# Altium project AirPi_Sensor.PrjPcb
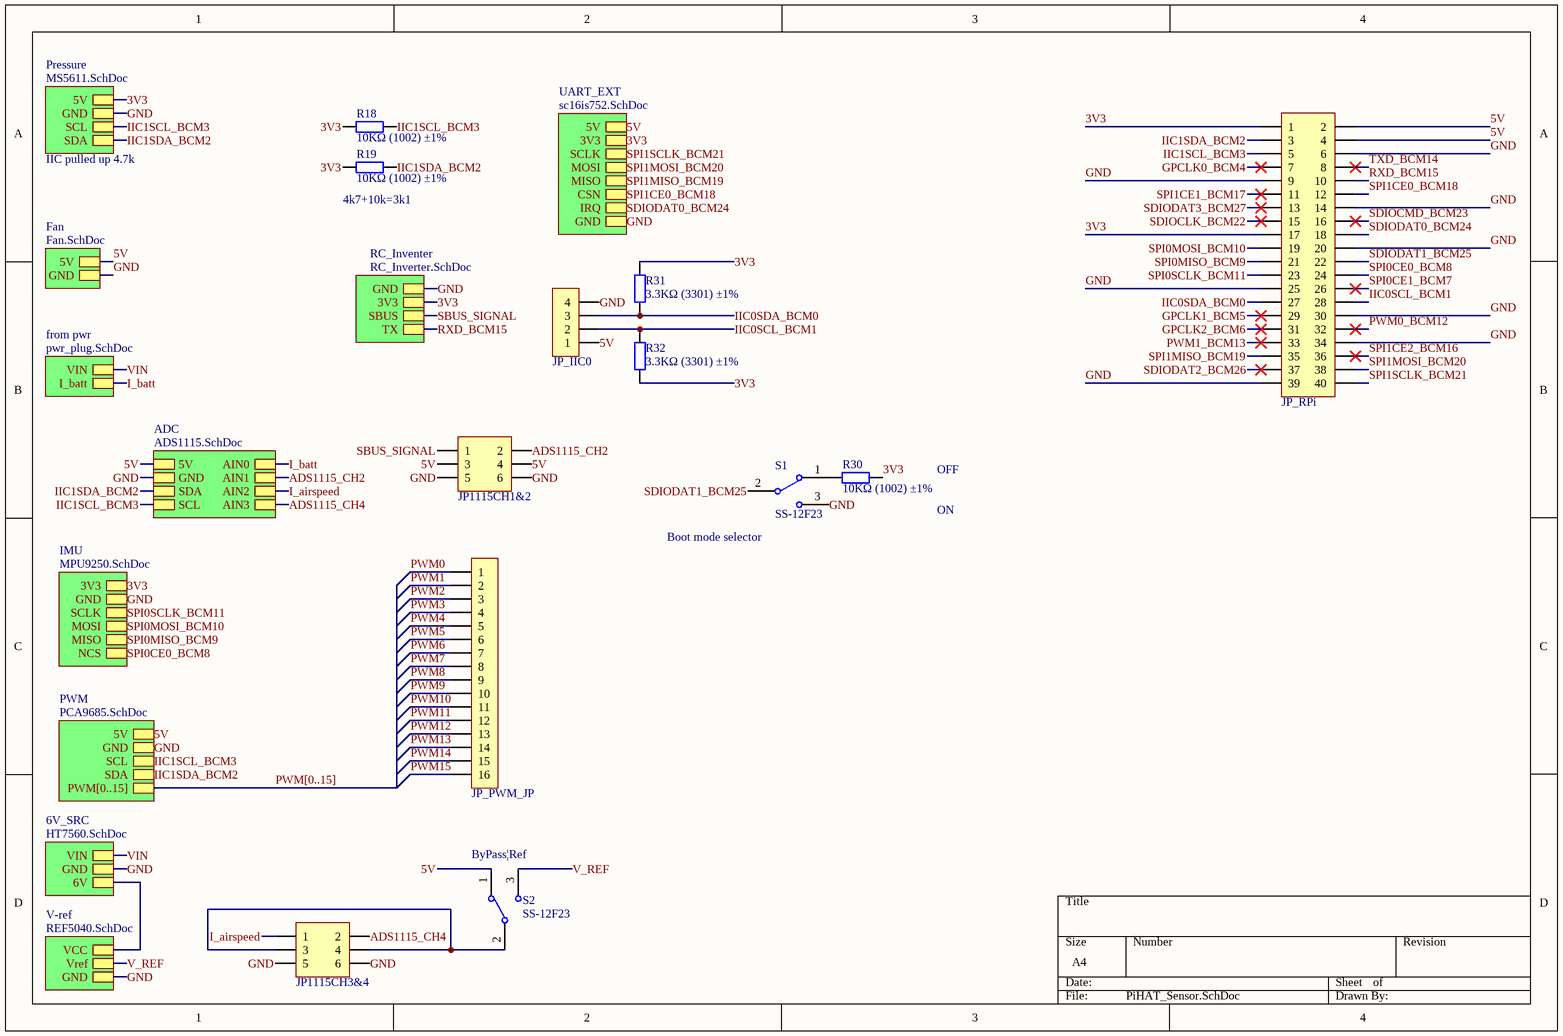
[diagram p0: PiHAT_Sensor.SchDoc]
11 sheets, 65 parts. Net scope: hierarchical (ports join the sheet entries above them; power ports are global).
Board file: AirPi_Sensor.PcbDoc
Sheets:
  PiHAT_Sensor.SchDoc
    Fan = Fan.SchDoc
    V-ref = REF5040.SchDoc
    from pwr = pwr_plug.SchDoc
    Pressure = MS5611.SchDoc
    ADC = ADS1115.SchDoc
    IMU = MPU9250.SchDoc
    PWM = PCA9685.SchDoc
    RC_Inventer = RC_Inverter.SchDoc
    UART_EXT = sc16is752.SchDoc
    6V_SRC = HT7560.SchDoc

## Sheet PiHAT_Sensor.SchDoc
size A4

### Parts
JP1115CH1&2  Header3X2  [HDR2.54-WI-2x3P]  (value not drawn)
JP1115CH3&4  Header3X2  [HDR2.54-WI-2x3P]  (value not drawn)
JP_IIC0  HDR-1X4  [MX 1.25-WS-4P]  (value not drawn)
JP_PWM_JP  HDR-1X16  [HDR2.54-LI-16P]  (value not drawn)
JP_RPi  Header 2X11  [HDR2.54-LI-2x20P]  (value not drawn)
R18  10KΩ (1002) ±1%  [0402_R]
R19  10KΩ (1002) ±1%  [0402_R]
R30  10KΩ (1002) ±1%  [0402_R]
R31  3.3KΩ (3301) ±1%  [0402_R]
R32  3.3KΩ (3301) ±1%  [0402_R]
S1  SS-12F23  [MSK-12C01-07]
S2  SS-12F23  [MSK-12C01-07]

### Sub-sheets
6V_SRC = HT7560.SchDoc: 6V, GND, VIN
ADC = ADS1115.SchDoc: SDA, AIN0, AIN3, AIN1, AIN2, 5V, GND, SCL
Fan = Fan.SchDoc: 5V, GND
from pwr = pwr_plug.SchDoc: I_batt, VIN
IMU = MPU9250.SchDoc: NCS, 3V3, GND, SCLK, MOSI, MISO
Pressure = MS5611.SchDoc: 5V, SCL, GND, SDA
PWM = PCA9685.SchDoc: PWM[0..15], SDA, SCL, GND, 5V
RC_Inventer = RC_Inverter.SchDoc: GND, TX, 3V3, SBUS
UART_EXT = sc16is752.SchDoc: CSN, 5V, SCLK, 3V3, GND, IRQ, MOSI, MISO
V-ref = REF5040.SchDoc: VCC, Vref, GND

### Nets
3V3: JP_RPi.1 JP_RPi.17 R18.1 R19.1 R30.2 R31.2 R32.1 ; sheet Pressure/5V, sheet IMU/3V3, sheet RC_Inventer/3V3, sheet UART_EXT/3V3
5V: JP1115CH1&2.3 JP1115CH1&2.4 JP_IIC0.1 JP_RPi.2 JP_RPi.4 S2.1 ; sheet Fan/5V, sheet ADC/5V, sheet PWM/5V, sheet UART_EXT/5V
ADS1115_CH2: JP1115CH1&2.2 ; sheet ADC/AIN1
ADS1115_CH4: JP1115CH3&4.2 ; sheet ADC/AIN3
GND: JP1115CH1&2.5 JP1115CH1&2.6 JP1115CH3&4.5 JP1115CH3&4.6 JP_IIC0.4 JP_RPi.6 JP_RPi.9 JP_RPi.14 JP_RPi.20 JP_RPi.25 JP_RPi.30 JP_RPi.34 JP_RPi.39 S1.3 ; sheet Fan/GND, sheet V-ref/GND, sheet Pressure/GND, sheet ADC/GND, sheet IMU/GND, sheet PWM/GND, sheet RC_Inventer/GND, sheet UART_EXT/GND, sheet 6V_SRC/GND
GPCLK0_BCM4: JP_RPi.7
GPCLK1_BCM5: JP_RPi.29
GPCLK2_BCM6: JP_RPi.31
I_airspeed: JP1115CH3&4.1 ; sheet ADC/AIN2
I_batt: sheet from pwr/I_batt, sheet ADC/AIN0
IIC0SCL_BCM1: JP_IIC0.2 JP_RPi.28 R32.2
IIC0SDA_BCM0: JP_IIC0.3 JP_RPi.27 R31.1
IIC1SCL_BCM3: JP_RPi.5 R18.2 ; sheet Pressure/SCL, sheet ADC/SCL, sheet PWM/SCL
IIC1SDA_BCM2: JP_RPi.3 R19.2 ; sheet Pressure/SDA, sheet ADC/SDA, sheet PWM/SDA
PWM0: JP_PWM_JP.1
PWM0_BCM12: JP_RPi.32
PWM1: JP_PWM_JP.2
PWM1_BCM13: JP_RPi.33
PWM2: JP_PWM_JP.3
PWM3: JP_PWM_JP.4
PWM4: JP_PWM_JP.5
PWM5: JP_PWM_JP.6
PWM6: JP_PWM_JP.7
PWM7: JP_PWM_JP.8
PWM8: JP_PWM_JP.9
PWM9: JP_PWM_JP.10
PWM10: JP_PWM_JP.11
PWM11: JP_PWM_JP.12
PWM12: JP_PWM_JP.13
PWM13: JP_PWM_JP.14
PWM14: JP_PWM_JP.15
PWM15: JP_PWM_JP.16
RXD_BCM15: JP_RPi.10 ; sheet RC_Inventer/TX
SBUS_SIGNAL: JP1115CH1&2.1 ; sheet RC_Inventer/SBUS
SDIOCLK_BCM22: JP_RPi.15
SDIOCMD_BCM23: JP_RPi.16
SDIODAT0_BCM24: JP_RPi.18 ; sheet UART_EXT/IRQ  [project net IRQ]
SDIODAT1_BCM25: JP_RPi.22 S1.2
SDIODAT2_BCM26: JP_RPi.37
SDIODAT3_BCM27: JP_RPi.13
SPI0CE0_BCM8: JP_RPi.24 ; sheet IMU/NCS
SPI0CE1_BCM7: JP_RPi.26
SPI0MISO_BCM9: JP_RPi.21 ; sheet IMU/MISO
SPI0MOSI_BCM10: JP_RPi.19 ; sheet IMU/MOSI
SPI0SCLK_BCM11: JP_RPi.23 ; sheet IMU/SCLK
SPI1CE0_BCM18: JP_RPi.12 ; sheet UART_EXT/CSN  [project net CSN]
SPI1CE1_BCM17: JP_RPi.11
SPI1CE2_BCM16: JP_RPi.36
SPI1MISO_BCM19: JP_RPi.35 ; sheet UART_EXT/MISO  [project net MISO]
SPI1MOSI_BCM20: JP_RPi.38 ; sheet UART_EXT/MOSI  [project net MOSI]
SPI1SCLK_BCM21: JP_RPi.40 ; sheet UART_EXT/SCLK  [project net SCLK]
TXD_BCM14: JP_RPi.8
V_REF: S2.3 ; sheet V-ref/Vref
VIN: sheet from pwr/VIN, sheet 6V_SRC/VIN
NetC3_2: sheet V-ref/VCC, sheet 6V_SRC/6V
NetJP1115CH3&4_3: JP1115CH3&4.3 JP1115CH3&4.4 S2.2
NetR30_1: R30.1 S1.1

### Buses and harness runs
bus PWM[0..15] = sheet PWM/PWM[0..15]

### Notes on the sheet
- IIC pulled up 4.7k
- (near R19) 4k7+10k=3k1
- OFF
- ON
- (near S1) Boot mode selector
- (near S2) ByPass|Ref

### Library data of the parts
JP1115CH1&2 JP1115CH3&4 = Header 3X2: 3*2P接插件; 版权归属: 源创客; BOM名称: 3*2P接插件; 学习资源: www.ooocke.com
JP_IIC0 = Header 4: 4P接插件; 版权归属: 源创客; BOM名称: 4P接插件; 学习资源: www.ooocke.com
JP_PWM_JP = Header 16: 16P接插件; 版权归属: 源创客; BOM名称: 16P接插件; 学习资源: www.ooocke.com
JP_RPi = Header 20X2: 20*2P接插件; 版权归属: 源创客; BOM名称: 20*2P接插件; 学习资源: www.ooocke.com
R18 R19 R30 = 0402 10KΩ (1002) 1%: 贴片电阻; ComponentLink1Description: 供应商链接; ComponentLink1URL: http://www.szlcsc.com/product/details_26487.html; Package: 0402; Supplier: LC; SuppliersPartNumber: C25744
R31 R32 = 0402 3.3KΩ (3301) 1%: 贴片电阻; ComponentLink1Description: 供应商链接; ComponentLink1URL: http://www.szlcsc.com/product/details_26633.html; Package: 0402; Supplier: LC; SuppliersPartNumber: C25890
S1 S2 = SSW-1P: 1路波动开关; BOM名称: 波动开关; 版权归属: 源创客; 学习资源: www.ooocke.com

## Sheet Fan.SchDoc
size A4
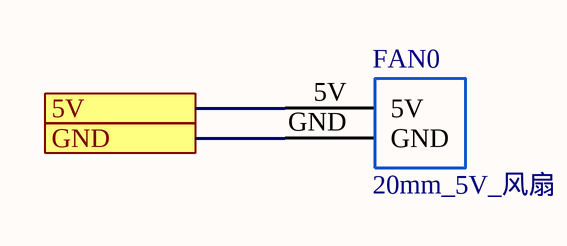
[diagram p1: Fan.SchDoc]

### Parts
FAN0  20mm_5V_风扇  [20mmFAN]

### Ports
5V, GND

### Nets
5V: FAN0.5V ; port 5V
GND: FAN0.GND ; port GND

### Library data of the parts
FAN0 = 20mmFAN: pin to pad: 5V>7 GND>6

## Sheet REF5040.SchDoc
size A4
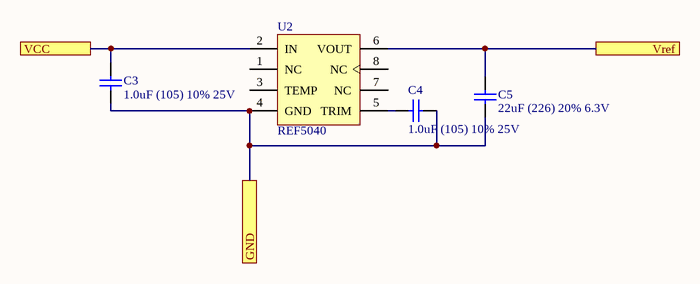
[diagram p2: REF5040.SchDoc]

### Parts
C3  1.0uF (105) 10% 25V  [0402_C]
C4  1.0uF (105) 10% 25V  [0402_C]
C5  22uF (226) 20% 6.3V  [0603_C]
U2  REF5040  [SOP8_N]

### Ports
GND, VCC, Vref

### Nets
GND: C3.1 C4.2 C5.1 U2.4(GND) ; port GND
V_REF: C5.2 U2.6(VOUT) ; port Vref
NetC3_2: C3.2 U2.2(IN) ; port VCC
NetC4_1: C4.1 U2.5(TRIM)

Not connected (* = marked no-connect by the designer): U2 1(NC) 3(TEMP) 7(NC) 8(NC)

### Library data of the parts
C3 C4 = 0402 1.0uF (105) 10% 25V: 贴片电容; ComponentLink1Description: 供应商链接; ComponentLink1URL: http://www.szlcsc.com/product/details_53938.html; Package: 0402; Supplier: LC; SuppliersPartNumber: C52923
C5 = 0603 22uF (226) 20% 6.3V: 贴片电容; ComponentLink1Description: 供应商链接; ComponentLink1URL: http://www.szlcsc.com/product/details_60514.html; Package: 0603; Supplier: LC; SuppliersPartNumber: C59461
U2 = REF5040: 高精度电压基准; 版权归属: 源创客; BOM名称: 高精度电压基准; 学习资源: www.ooocke.com

## Sheet pwr_plug.SchDoc
size A4
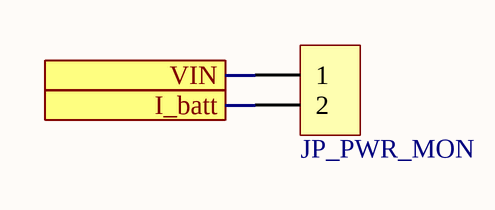
[diagram p3: pwr_plug.SchDoc]

### Parts
JP_PWR_MON  HDR-1X2  [HDR2.54-LI-2P]  (value not drawn)

### Ports
I_batt, VIN

### Nets
I_batt: JP_PWR_MON.2 ; port I_batt
VIN: JP_PWR_MON.1 ; port VIN

### Library data of the parts
JP_PWR_MON = Header 2: 2P接插件; 版权归属: 源创客; BOM名称: 2P接插件; 学习资源: www.ooocke.com

## Sheet MS5611.SchDoc
size A4
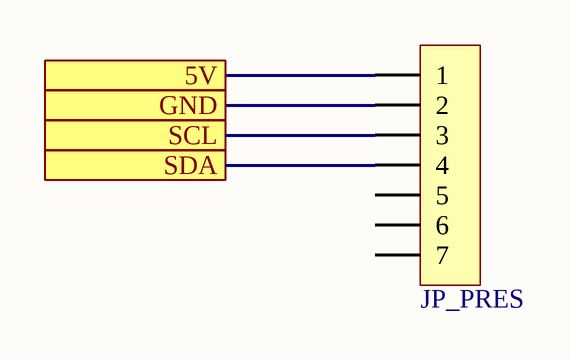
[diagram p4: MS5611.SchDoc]

### Parts
JP_PRES  HDR-1X7  [HDR2.54-LI-7P]  (value not drawn)

### Ports
5V, GND, SCL, SDA

### Nets
3V3: JP_PRES.1 ; port 5V
GND: JP_PRES.2 ; port GND
IIC1SCL_BCM3: JP_PRES.3 ; port SCL
IIC1SDA_BCM2: JP_PRES.4 ; port SDA

Not connected (* = marked no-connect by the designer): JP_PRES 5 6 7

### Library data of the parts
JP_PRES = Header 7: 7P接插件; 版权归属: 源创客; BOM名称: 7P接插件; 学习资源: www.ooocke.com

## Sheet ADS1115.SchDoc
size A4

## Sheet MPU9250.SchDoc
size A4
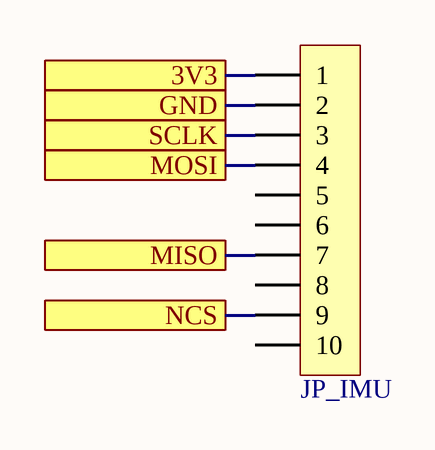
[diagram p5: MPU9250.SchDoc]

### Parts
JP_IMU  HDR-1X10  [HDR2.54-LI-10P]  (value not drawn)

### Ports
3V3, GND, MISO, MOSI, NCS, SCLK

### Nets
3V3: JP_IMU.1 ; port 3V3
GND: JP_IMU.2 ; port GND
SPI0CE0_BCM8: JP_IMU.9 ; port NCS
SPI0MISO_BCM9: JP_IMU.7 ; port MISO
SPI0MOSI_BCM10: JP_IMU.4 ; port MOSI
SPI0SCLK_BCM11: JP_IMU.3 ; port SCLK

Not connected (* = marked no-connect by the designer): JP_IMU 5 6 8 10

### Library data of the parts
JP_IMU = Header 10: 10P接插件; 版权归属: 源创客; BOM名称: 10P接插件; 学习资源: www.ooocke.com

## Sheet PCA9685.SchDoc
size A4
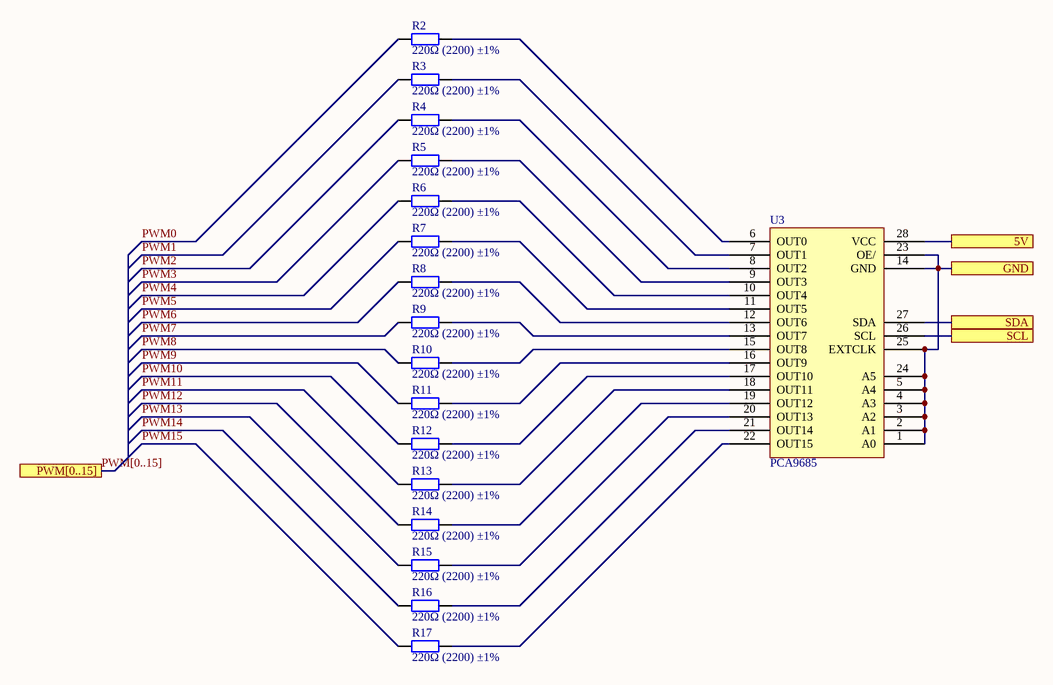
[diagram p6: PCA9685.SchDoc]

### Parts
R2  220Ω (2200) ±1%  [0402_R]
R3  220Ω (2200) ±1%  [0402_R]
R4  220Ω (2200) ±1%  [0402_R]
R5  220Ω (2200) ±1%  [0402_R]
R6  220Ω (2200) ±1%  [0402_R]
R7  220Ω (2200) ±1%  [0402_R]
R8  220Ω (2200) ±1%  [0402_R]
R9  220Ω (2200) ±1%  [0402_R]
R10  220Ω (2200) ±1%  [0402_R]
R11  220Ω (2200) ±1%  [0402_R]
R12  220Ω (2200) ±1%  [0402_R]
R13  220Ω (2200) ±1%  [0402_R]
R14  220Ω (2200) ±1%  [0402_R]
R15  220Ω (2200) ±1%  [0402_R]
R16  220Ω (2200) ±1%  [0402_R]
R17  220Ω (2200) ±1%  [0402_R]
U3  PCA9685  [TSSOP28_M]

### Ports
5V, GND, PWM[0..15], SCL, SDA

### Nets
5V: U3.28(VCC) ; port 5V
GND: U3.1(A0) U3.2(A1) U3.3(A2) U3.4(A3) U3.5(A4) U3.14(GND) U3.23(OE/) U3.24(A5) U3.25(EXTCLK) ; port GND
IIC1SCL_BCM3: U3.26(SCL) ; port SCL
IIC1SDA_BCM2: U3.27(SDA) ; port SDA
PWM0: R2.1
PWM1: R3.1
PWM2: R4.1
PWM3: R5.1
PWM4: R6.1
PWM5: R7.1
PWM6: R8.1
PWM7: R9.1
PWM8: R10.1
PWM9: R11.1
PWM10: R12.1
PWM11: R13.1
PWM12: R14.1
PWM13: R15.1
PWM14: R16.1
PWM15: R17.1
NetR2_2: R2.2 U3.6(OUT0)
NetR3_2: R3.2 U3.7(OUT1)
NetR4_2: R4.2 U3.8(OUT2)
NetR5_2: R5.2 U3.9(OUT3)
NetR6_2: R6.2 U3.10(OUT4)
NetR7_2: R7.2 U3.11(OUT5)
NetR8_2: R8.2 U3.12(OUT6)
NetR9_2: R9.2 U3.13(OUT7)
NetR10_2: R10.2 U3.15(OUT8)
NetR11_2: R11.2 U3.16(OUT9)
NetR12_2: R12.2 U3.17(OUT10)
NetR13_2: R13.2 U3.18(OUT11)
NetR14_2: R14.2 U3.19(OUT12)
NetR15_2: R15.2 U3.20(OUT13)
NetR16_2: R16.2 U3.21(OUT14)
NetR17_2: R17.2 U3.22(OUT15)

### Buses and harness runs
bus PWM[0..15] = port PWM[0..15]

### Library data of the parts
R2-R17 = 0402 220Ω (2200) 1%: 贴片电阻; ComponentLink1Description: 供应商链接; ComponentLink1URL: http://www.szlcsc.com/product/details_25834.html; Package: 0402; Supplier: LC; SuppliersPartNumber: C25091
U3 = PCA9685: 16-channel, 12-bit PWM Fm+ I2C-bus LED controller

## Sheet RC_Inverter.SchDoc
size A4
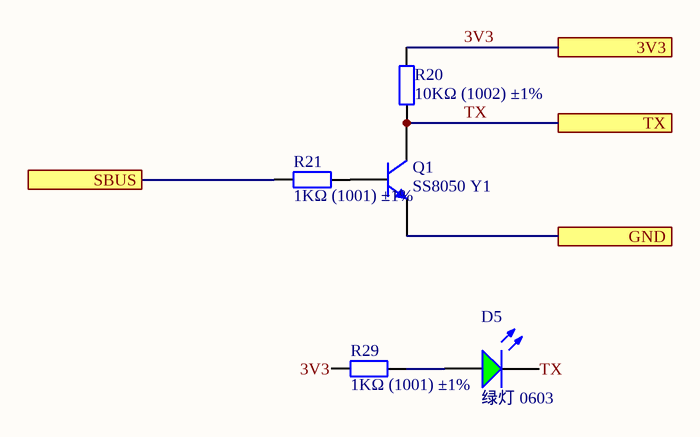
[diagram p7: RC_Inverter.SchDoc]

### Parts
D5  绿灯 0603  [0603_LED_S1]
Q1  SS8050 Y1  [SOT-23(SOT-23-3)]
R20  10KΩ (1002) ±1%  [0402_R]
R21  1KΩ (1001) ±1%  [0402_R]
R29  1KΩ (1001) ±1%  [0402_R]

### Ports
3V3, GND, SBUS, TX

### Nets
3V3: R20.2 R29.1 ; port 3V3
GND: Q1.2(E) ; port GND
SBUS_SIGNAL: R21.1 ; port SBUS
TX: D5.K Q1.3(C) R20.1 ; port TX  [project net RXD_BCM15]
NetD5_A: D5.A R29.2
NetQ1_1: Q1.1(B) R21.2

### Library data of the parts
D5 = 0603 绿灯: 发光二极管; ComponentLink1Description: 供应商链接; ComponentLink1URL: http://www.szlcsc.com/product/details_73152.html; Package: 0603; Supplier: LC; SuppliersPartNumber: C72043
Q1 = SOT-23 SS8050 Y1: 三极管; ComponentLink1Description: 供应商链接; ComponentLink1URL: http://www.szlcsc.com/product/details_2507.html; Package: SOT-23; Supplier: LC; SuppliersPartNumber: C2150
R20 = 0402 10KΩ (1002) 1%: 贴片电阻; ComponentLink1Description: 供应商链接; ComponentLink1URL: http://www.szlcsc.com/product/details_26487.html; Package: 0402; Supplier: LC; SuppliersPartNumber: C25744
R21 R29 = 0402 1KΩ (1001) 1%: 贴片电阻; ComponentLink1Description: 供应商链接; ComponentLink1URL: http://www.szlcsc.com/product/details_12256.html; Package: 0402; Supplier: LC; SuppliersPartNumber: C11702

## Sheet sc16is752.SchDoc
size A4
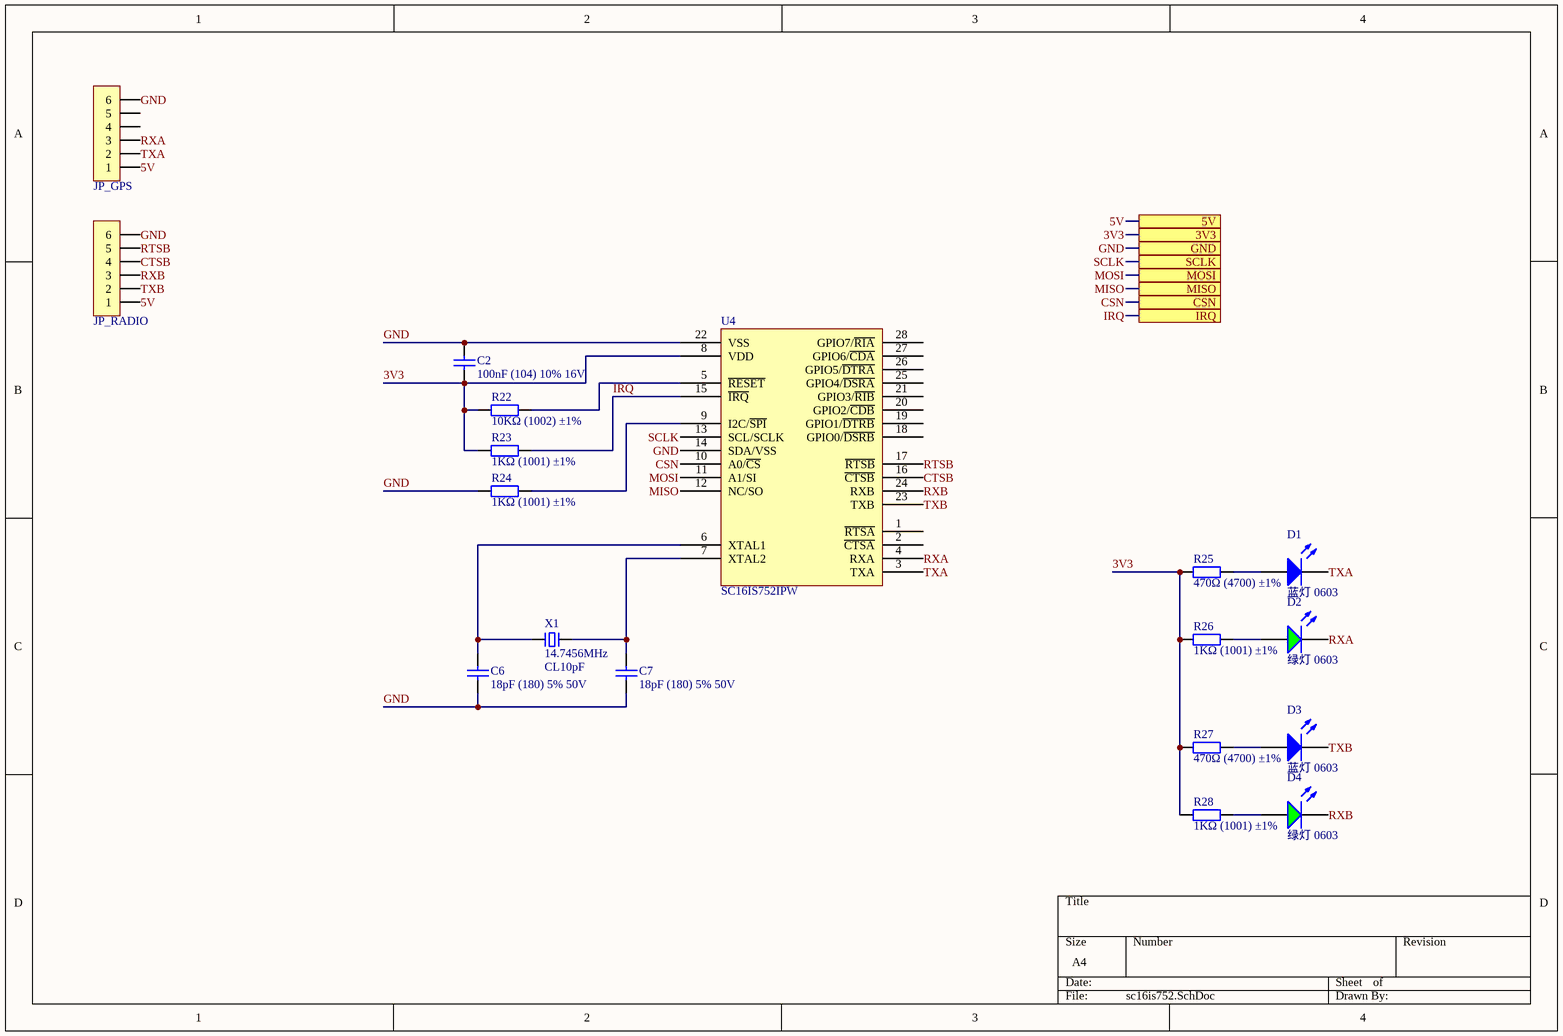
[diagram p8: sc16is752.SchDoc]

### Parts
C2  100nF (104) 10% 16V  [0402_C]
C6  18pF (180) 5% 50V  [0402_C]
C7  18pF (180) 5% 50V  [0402_C]
D1  蓝灯 0603  [0603_LED_S1]
D2  绿灯 0603  [0603_LED_S1]
D3  蓝灯 0603  [0603_LED_S1]
D4  绿灯 0603  [0603_LED_S1]
JP_GPS  HDR-1X6  [MX 1.25-WS-6P]  (value not drawn)
JP_RADIO  HDR-1X6  [MX 1.25-WS-6P]  (value not drawn)
R22  10KΩ (1002) ±1%  [0402_R]
R23  1KΩ (1001) ±1%  [0402_R]
R24  1KΩ (1001) ±1%  [0402_R]
R25  470Ω (4700) ±1%  [0402_R]
R26  1KΩ (1001) ±1%  [0402_R]
R27  470Ω (4700) ±1%  [0402_R]
R28  1KΩ (1001) ±1%  [0402_R]
U4  SC16IS752IPW  [TSSOP28_n]
X1  14.7456MHz  负载电容: CL10pF  [OSC HC-49SMD]

### Ports
3V3, 5V, CSN, GND, IRQ, MISO, MOSI, SCLK

### Nets
3V3: C2.1 R22.1 R23.1 R25.1 R26.1 R27.1 R28.1 U4.8(VDD) ; port 3V3
5V: JP_GPS.1 JP_RADIO.1 ; port 5V
CSN: U4.10(A0/~{CS}) ; port CSN
CTSB: JP_RADIO.4 U4.16(~{CTSB})
GND: C2.2 C6.1 C7.1 JP_GPS.6 JP_RADIO.6 R24.1 U4.14(SDA/VSS) U4.22(VSS) ; port GND
IRQ: R23.2 U4.15(~{IRQ}) ; port IRQ
MISO: U4.12(NC/SO) ; port MISO
MOSI: U4.11(A1/SI) ; port MOSI
RTSB: JP_RADIO.5 U4.17(~{RTSB})
RXA: D2.K JP_GPS.3 U4.4(RXA)
RXB: D4.K JP_RADIO.3 U4.24(RXB)
SCLK: U4.13(SCL/SCLK) ; port SCLK
TXA: D1.K JP_GPS.2 U4.3(TXA)
TXB: D3.K JP_RADIO.2 U4.23(TXB)
NetC6_2: C6.2 U4.6(XTAL1) X1.1
NetC7_2: C7.2 U4.7(XTAL2) X1.2
NetD1_A: D1.A R25.2
NetD2_A: D2.A R26.2
NetD3_A: D3.A R27.2
NetD4_A: D4.A R28.2
NetR22_2: R22.2 U4.5(~{RESET})
NetR24_2: R24.2 U4.9(I2C/~{SPI})

Not connected (* = marked no-connect by the designer): JP_GPS 4 5; U4 1(~{RTSA}) 2(~{CTSA}) 18(GPIO0/~{DSRB}) 19(GPIO1/~{DTRB}) 20(GPIO2/~{CDB}) 21(GPIO3/~{RIB}) 25(GPIO4/~{DSRA}) 26(GPIO5/~{DTRA}) 27(GPIO6/~{CDA}) 28(GPIO7/~{RIA})

### Library data of the parts
C2 = 0402 100nF (104) 10% 16V: 贴片电容; ComponentLink1Description: 供应商链接; ComponentLink1URL: http://www.szlcsc.com/product/details_1877.html; Package: 0402; Supplier: LC; SuppliersPartNumber: C1525
C6 C7 = 0402 18pF (180) 5% 50V: 贴片电容; ComponentLink1Description: 供应商链接; ComponentLink1URL: http://www.szlcsc.com/product/details_1901.html; Package: 0402; Supplier: LC; SuppliersPartNumber: C1549
D1 D3 = 0603 蓝灯: 发光二极管; ComponentLink1Description: 供应商链接; ComponentLink1URL: http://www.szlcsc.com/product/details_73150.html; Package: 0603; Supplier: LC; SuppliersPartNumber: C72041
D2 D4 = 0603 绿灯: 发光二极管; ComponentLink1Description: 供应商链接; ComponentLink1URL: http://www.szlcsc.com/product/details_73152.html; Package: 0603; Supplier: LC; SuppliersPartNumber: C72043
JP_GPS JP_RADIO = Header 6: 6P接插件; 版权归属: 源创客; BOM名称: 6P接插件; 学习资源: www.ooocke.com
R22 = 0402 10KΩ (1002) 1%: 贴片电阻; ComponentLink1Description: 供应商链接; ComponentLink1URL: http://www.szlcsc.com/product/details_26487.html; Package: 0402; Supplier: LC; SuppliersPartNumber: C25744
R23 R24 R26 R28 = 0402 1KΩ (1001) 1%: 贴片电阻; ComponentLink1Description: 供应商链接; ComponentLink1URL: http://www.szlcsc.com/product/details_12256.html; Package: 0402; Supplier: LC; SuppliersPartNumber: C11702
R25 R27 = 0402 470Ω (4700) 1%: 贴片电阻; ComponentLink1Description: 供应商链接; ComponentLink1URL: http://www.szlcsc.com/product/details_25860.html; Package: 0402; Supplier: LC; SuppliersPartNumber: C25117
X1 = XTAL-2P: 2脚无源脚晶振; 版权归属: 源创客; BOM名称: 2脚无源脚晶振; 学习资源: www.ooocke.com

## Sheet HT7560.SchDoc
size A4
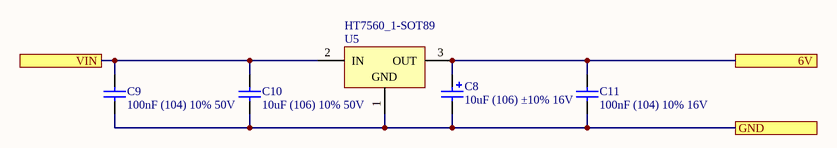
[diagram p9: HT7560.SchDoc]

### Parts
C8  10uF (106) ±10% 16V  [CASE-A_3216]
C9  100nF (104) 10% 50V  [0603_C]
C10  10uF (106) 10% 50V  [1206_C]
C11  100nF (104) 10% 16V  [0402_C]
U5  HT7560_1-SOT89  [SOT89_N]

### Ports
6V, GND, VIN

### Nets
GND: C8.2 C9.1 C10.2 C11.2 U5.1(GND) ; port GND
VIN: C9.2 C10.1 U5.2(IN) ; port VIN
NetC3_2: C8.1 C11.1 U5.3(OUT) ; port 6V

### Library data of the parts
C8 = 3216 10uF (106) 10% 16V: 钽电容; ComponentLink1Description: 供应商链接; ComponentLink1URL: http://www.szlcsc.com/product/details_7643.html; Package: 3216; Supplier: LC; SuppliersPartNumber: C7171
C9 = 0603 100nF (104) 10% 50V: 贴片电容; ComponentLink1Description: 供应商链接; ComponentLink1URL: http://www.szlcsc.com/product/details_15331.html; Package: 0603; Supplier: LC; SuppliersPartNumber: C14663
C10 = 1206 10uF (106) 10% 50V: 贴片电容; ComponentLink1Description: 供应商链接; ComponentLink1URL: http://www.szlcsc.com/product/details_14236.html; Package: 1206; Supplier: LC; SuppliersPartNumber: C13585
C11 = 0402 100nF (104) 10% 16V: 贴片电容; ComponentLink1Description: 供应商链接; ComponentLink1URL: http://www.szlcsc.com/product/details_1877.html; Package: 0402; Supplier: LC; SuppliersPartNumber: C1525
U5 = HT7560_1-SOT89: 100mA Low Power LDO, Output Voltage 6.0V, SOT89 Pkg; DatasheetVersion: Rev1.80, Mar-2010; PackageVersion: 25/05/2010; PackageReference: SOT89; PackageDescription: 3-Pin SOT-89 Package 1.5 mm Pitch, 4.1 mm Lead Span; Code_IPC: SOT89; ComponentLink1Description: Manufacturer URL; ComponentLink1URL: http://www.holtek.com/; ComponentLink2Description: Datasheet; ComponentLink2URL: http://www.holtek.com/pdf/consumer/75xx_1v180.pdf; ComponentLink3Description: Package Specification; ComponentLink3URL: http://www.holtek.com/english/literature/package.pdf

## Nets that join several sheets
3V3: PiHAT_Sensor (7 pins), MS5611 (JP_PRES.1), MPU9250 (JP_IMU.1), RC_Inverter (R20.2 R29.1), sc16is752 (8 pins)
5V: PiHAT_Sensor (6 pins), Fan (FAN0.5V), PCA9685 (U3.28), sc16is752 (JP_GPS.1 JP_RADIO.1)
CSN: PiHAT_Sensor (JP_RPi.12), sc16is752 (U4.10)
GND: PiHAT_Sensor (14 pins), Fan (FAN0.GND), REF5040 (C3.1 C4.2 C5.1 U2.4), MS5611 (JP_PRES.2), MPU9250 (JP_IMU.2), PCA9685 (9 pins), RC_Inverter (Q1.2), sc16is752 (8 pins), HT7560 (5 pins)
IIC1SCL_BCM3: PiHAT_Sensor (JP_RPi.5 R18.2), MS5611 (JP_PRES.3), PCA9685 (U3.26)
IIC1SDA_BCM2: PiHAT_Sensor (JP_RPi.3 R19.2), MS5611 (JP_PRES.4), PCA9685 (U3.27)
IRQ: PiHAT_Sensor (JP_RPi.18), sc16is752 (R23.2 U4.15)
MISO: PiHAT_Sensor (JP_RPi.35), sc16is752 (U4.12)
MOSI: PiHAT_Sensor (JP_RPi.38), sc16is752 (U4.11)
NetC3_2: REF5040 (C3.2 U2.2), HT7560 (C8.1 C11.1 U5.3)
PWM0: PiHAT_Sensor (JP_PWM_JP.1), PCA9685 (R2.1)
PWM1: PiHAT_Sensor (JP_PWM_JP.2), PCA9685 (R3.1)
PWM2: PiHAT_Sensor (JP_PWM_JP.3), PCA9685 (R4.1)
PWM3: PiHAT_Sensor (JP_PWM_JP.4), PCA9685 (R5.1)
PWM4: PiHAT_Sensor (JP_PWM_JP.5), PCA9685 (R6.1)
PWM5: PiHAT_Sensor (JP_PWM_JP.6), PCA9685 (R7.1)
PWM6: PiHAT_Sensor (JP_PWM_JP.7), PCA9685 (R8.1)
PWM7: PiHAT_Sensor (JP_PWM_JP.8), PCA9685 (R9.1)
PWM8: PiHAT_Sensor (JP_PWM_JP.9), PCA9685 (R10.1)
PWM9: PiHAT_Sensor (JP_PWM_JP.10), PCA9685 (R11.1)
PWM10: PiHAT_Sensor (JP_PWM_JP.11), PCA9685 (R12.1)
PWM11: PiHAT_Sensor (JP_PWM_JP.12), PCA9685 (R13.1)
PWM12: PiHAT_Sensor (JP_PWM_JP.13), PCA9685 (R14.1)
PWM13: PiHAT_Sensor (JP_PWM_JP.14), PCA9685 (R15.1)
PWM14: PiHAT_Sensor (JP_PWM_JP.15), PCA9685 (R16.1)
PWM15: PiHAT_Sensor (JP_PWM_JP.16), PCA9685 (R17.1)
RXD_BCM15: PiHAT_Sensor (JP_RPi.10), RC_Inverter (D5.K Q1.3 R20.1)
SBUS_SIGNAL: PiHAT_Sensor (JP1115CH1&2.1), RC_Inverter (R21.1)
SCLK: PiHAT_Sensor (JP_RPi.40), sc16is752 (U4.13)
SPI0CE0_BCM8: PiHAT_Sensor (JP_RPi.24), MPU9250 (JP_IMU.9)
SPI0MISO_BCM9: PiHAT_Sensor (JP_RPi.21), MPU9250 (JP_IMU.7)
SPI0MOSI_BCM10: PiHAT_Sensor (JP_RPi.19), MPU9250 (JP_IMU.4)
SPI0SCLK_BCM11: PiHAT_Sensor (JP_RPi.23), MPU9250 (JP_IMU.3)
V_REF: PiHAT_Sensor (S2.3), REF5040 (C5.2 U2.6)
VIN: pwr_plug (JP_PWR_MON.1), HT7560 (C9.2 C10.1 U5.2)